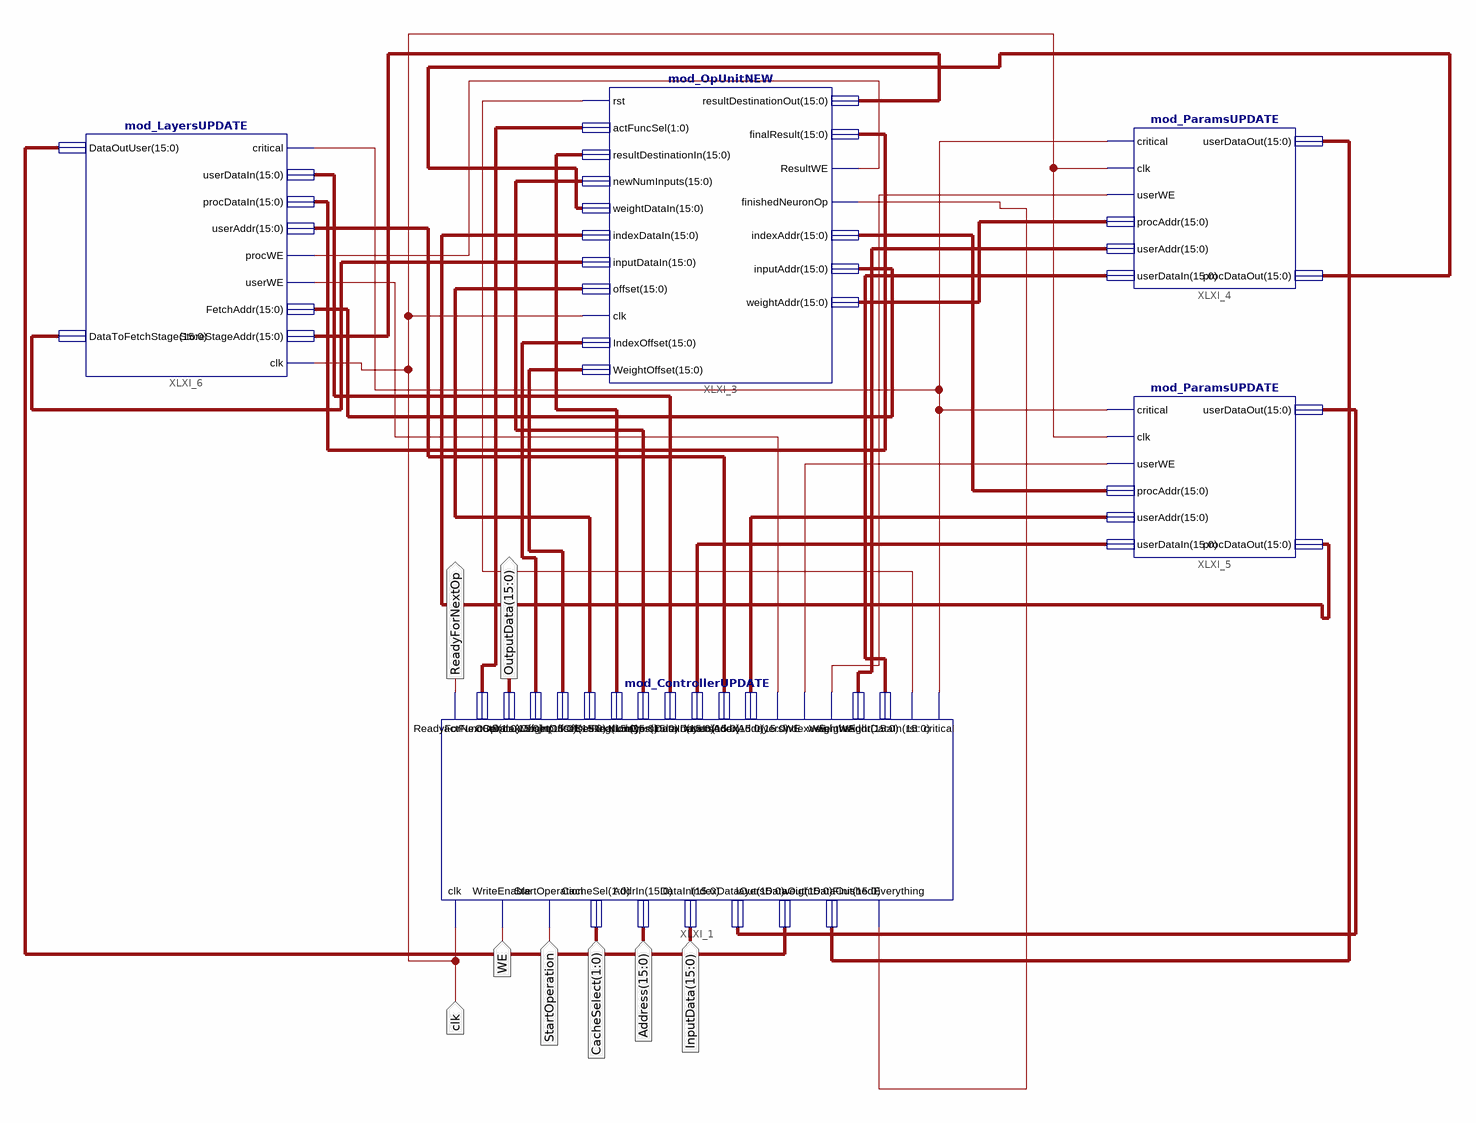
[diagram p0: schematic sheet 1]
// Xilinx ISE schematic TheNeuroSpider.sch (spartan3e) as structural Verilog: 5 symbols, 8 ports
module TheNeuroSpider (
  input  clk,
  input  [15:0] InputData,
  input  [15:0] Address,
  input  [1:0] CacheSelect,
  input  StartOperation,
  input  WE,
  output ReadyForNextOp,
  output [15:0] OutputData
);

  wire XLXN_10, XLXN_11, XLXN_15, XLXN_17, XLXN_18, XLXN_19, XLXN_30;
  wire [1:0] XLXN_33;
  wire [15:0] XLXN_6, XLXN_7, XLXN_12, XLXN_13, XLXN_14, XLXN_16, XLXN_21, XLXN_22, XLXN_23, XLXN_24,
       XLXN_25, XLXN_26, XLXN_27, XLXN_28, XLXN_31, XLXN_34, XLXN_35, XLXN_36, XLXN_40, XLXN_41, XLXN_43,
       XLXN_45;

  mod_ControllerUPDATE XLXI_1 (
    .clk(clk), .WriteEnable(WE), .StartOperation(StartOperation), .CacheSel(CacheSelect), .AddrIn(Address),
    .DataIn(InputData), .IndexDataOut(XLXN_27), .layersDataOut(XLXN_6), .weightDataOut(XLXN_28),
    .FinishedEverything(XLXN_30), .ReadyForNextOp(ReadyForNextOp), .actFuncSel(XLXN_33),
    .OutData(OutputData), .indexOffset(XLXN_40), .weightOffset(XLXN_41), .inputOffsetReg(XLXN_36),
    .Destination(XLXN_34), .NumOps(XLXN_35), .layersDataIn(XLXN_13), .indexDataIn(XLXN_26),
    .layersAddr(XLXN_16), .indexAddr(XLXN_25), .layersWE(XLXN_11), .indexWE(XLXN_19), .weightWE(XLXN_17),
    .weightAddr(XLXN_22), .weightDataIn(XLXN_23), .rst(XLXN_10), .critical(XLXN_18));
  mod_OpUnitNEW XLXI_3 (
    .rst(XLXN_10), .actFuncSel(XLXN_33), .resultDestinationIn(XLXN_34), .newNumInputs(XLXN_35),
    .weightDataIn(XLXN_43), .indexDataIn(XLXN_45), .inputDataIn(XLXN_7), .offset(XLXN_36), .clk(clk),
    .IndexOffset(XLXN_40), .WeightOffset(XLXN_41), .resultDestinationOut(XLXN_31), .finalResult(XLXN_14),
    .ResultWE(XLXN_15), .finishedNeuronOp(XLXN_30), .indexAddr(XLXN_24), .inputAddr(XLXN_12),
    .weightAddr(XLXN_21));
  mod_ParamsUPDATE XLXI_4 (
    .critical(XLXN_18), .clk(clk), .userWE(XLXN_17), .procAddr(XLXN_21), .userAddr(XLXN_22),
    .userDataIn(XLXN_23), .userDataOut(XLXN_28), .procDataOut(XLXN_43));
  mod_ParamsUPDATE XLXI_5 (
    .critical(XLXN_18), .clk(clk), .userWE(XLXN_19), .procAddr(XLXN_24), .userAddr(XLXN_25),
    .userDataIn(XLXN_26), .userDataOut(XLXN_27), .procDataOut(XLXN_45));
  mod_LayersUPDATE XLXI_6 (
    .critical(XLXN_18), .userDataIn(XLXN_13), .procDataIn(XLXN_14), .userAddr(XLXN_16), .procWE(XLXN_15),
    .userWE(XLXN_11), .FetchAddr(XLXN_12), .StoreStageAddr(XLXN_31), .DataOutUser(XLXN_6),
    .DataToFetchStage(XLXN_7), .clk(clk));
endmodule
